# Altium schematic sheet SH4 - POWER.SchDoc: POWER
size B; Engineer: Tibi Andronescu; Revision: 1; SheetNumber: 4; SheetTotal: 4
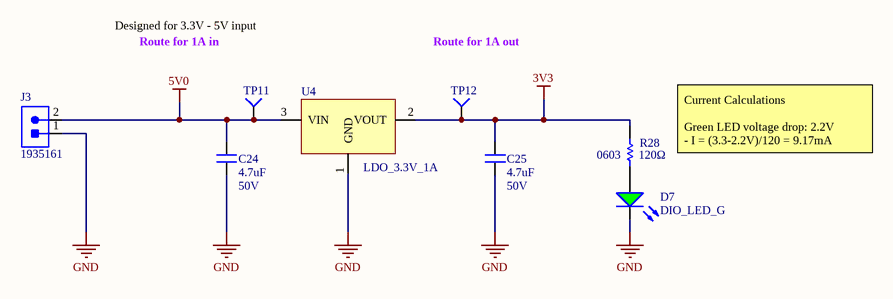
[diagram p0: SH4 - POWER.SchDoc]

## Parts
C24  Capacitance: 4.7uF  Voltage: 50V  [CAP1206]  (hidden comment: CAP_4.7uF_50V_1206)
C25  Capacitance: 4.7uF  Voltage: 50V  [CAP1206]  (hidden comment: CAP_4.7uF_50V_1206)
D7  DIO_LED_G  [LED_0805_GREEN]
J3  CON_2M_TERM  [1935161]  (value not drawn)
R28  value 120Ω  Package/Footprint: 0603  [RESC0603]  (hidden comment: RES_120Ω_0603)
TP11  TESTPOINT_SMD_LOOP  [S1751-46R]  (value not drawn)
TP12  TESTPOINT_SMD_LOOP  [S1751-46R]  (value not drawn)
U4  LDO_3.3V_1A

## Nets
3V3: C25.2 R28.2 TP12.1(=value) U4.2(VOUT)
5V0: C24.2 J3.2 TP11.1(=value) U4.3(VIN)
GND: C24.1 C25.1 D7.2(K) J3.1 U4.1(GND)
NetD7_1: D7.1(A) R28.1

## Notes on the sheet
- Designed for 3.3V - 5V input
- Route for 1A in
- Route for 1A out
- Current Calculations
  Green LED voltage drop: 2.2V
  - I = (3.3-2.2V)/120 = 9.17mA
- Title:
- Project:
- Date:
- Rev:
- Reviewer:
- Engineer:
- Sheet:
- of

## Library data of the parts
C24 C25 = CAP_4.7uF_50V_1206: CAP CER 4.7UF 50V X7R 1206; Manufacturer Part Number 1: GRM31CR71H475KA12L; Manufacturer 1: Murata; Package/Footprint: 1206; Supplier Part Number 1: 490-6521-1-ND; Supplier 1: Digi-Key; Dielectric: X7R; Mounting Type: SMD
D7 = DIO_LED_G: LED GREEN DIFFUSED 0805 SMD; Manufacturer Part Number 1: LG R971-KN-1; Manufacturer 1: OSRAM; Forward Voltage Drop: 2.2V; Package/Footprint: 0805; Supplier Part Number 1: 475-1410-1-ND; Supplier 1: Digi-Key; Mounting Type: SMD
J3 = CON_2M_TERM: TERM BLK 2POS SIDE ENTRY 5MM; Manufacturer 1: Phoenix Contact; Max Current Rating: 16A; Current: 18A; Voltage: 300V; Package/Footprint: SMD; Supplier 1: Digi-Key; Supplier Part Number 1: 277-1667-ND; Manufacturer Part Number 1: 1935161; Mounting Type: TH
R28 = RES_120Ω_0603_5%: RES 120 OHM 5% 1/10W 0603; Manufacturer 1: Yageo; Manufacturer Part Number 1: RC0603JR-07120RL; Package: 0603 (1608 Metric); Supplier Part Number 1: 311-120GRCT-ND; Supplier 1: Digi-Key; Mounting Type: SMD
TP11 TP12 = TESTPOINT_SMD_LOOP: PC TEST POINT SMD; Manufacturer 1: Harwin; Supplier 1: Digi-Key; Manufacturer Part Number 1: S1751-46R; Supplier Part Number 1: 952-1478-1-ND; Mounting Type: SMD; Package/Footprint: SMD
U4 = LDO_3.3V_1A: IC REG LINEAR 3.3V 1A SOT223; Manufacturer 1: Diodes Incorperated; Manufacturer Part Number 1: ZLDO1117G33TA; Input Voltage (Max): 18V; Voltage Dropout (Max): 1.3V@1A; Package/Footprint: SOT-224; Supplier 1: Digi-Key; Supplier Part Number 1: ZLDO1117G33DICT-ND; Output Voltage (Fixed): 3.3V; Output Current: 1A; Operating Temperature: -40°C - 125°C; Mounting Type: Surface Mount